# Altium schematic sheet sheet4.SchDoc
size A2
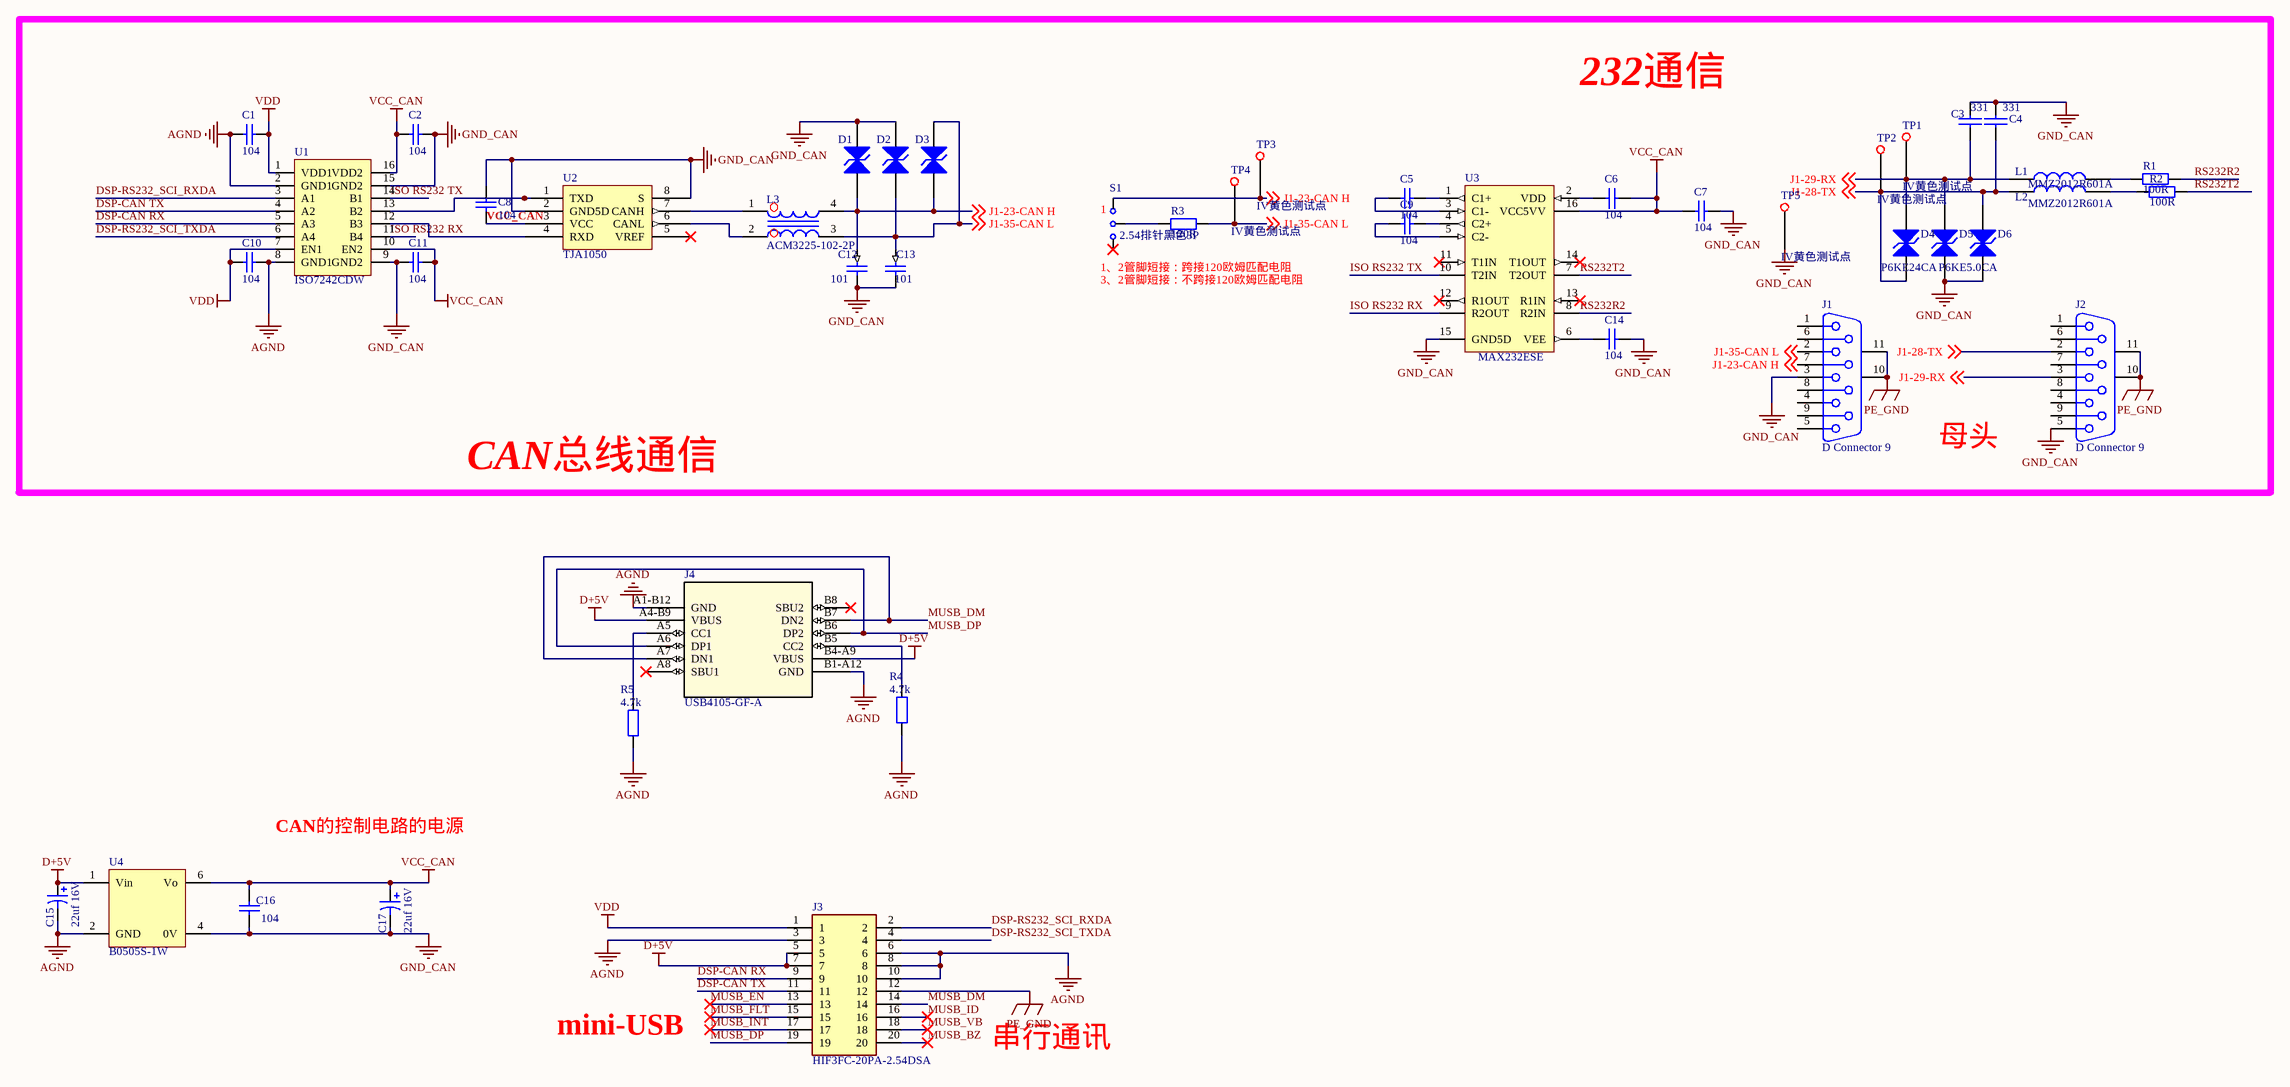
[diagram p0: sheet4.SchDoc]

## Parts
C1  104  [0805]
C2  104  [0805]
C3  331  [0805]
C4  331  [0805]
C5  104  [0805]
C6  104  [0805]
C7  104  [0805]
C8  104  [0805]
C9  104  [0805]
C10  104  [0805]
C11  104  [0805]
C12  101  [0805]
C13  101  [0805]
C14  104  [0805]
C15  22uf 16V  [1206 (钽电容)]
C16  104  [0805]
C17  22uf 16V  [1206 (钽电容)]
D1  (no value)  [DO214AA]
D2  (no value)  [DO214AA]
D3  (no value)  [DO214AA]
D4  P6KE24CA  [DO214AA]
D5  P6KE5.0CA  [DO214AA]
D6  (no value)  [DO214AA]
J1  D Connector 9  [DSUB1.385-2H9]
J2  D Connector 9  [DSUB1.385-2H9]
J3  HIF3FC-20PA-2.54DSA  [SHDR20W56P254_2X10_3290X850X950P]
J4  USB4105-GF-A  [USB4105_GCT]
L1  MMZ2012R601A  [0805]
L2  MMZ2012R601A  [0805]
L3  ACM3225-102-2P  [ACM3225]
R1  100R  [0805]
R2  100R  [0805]
R3  120R  [0805]
R4  4.7k  [0805]
R5  4.7k  [0805]
S1  2.54排针黑色3P  [SIP3]
TP1  IV黄色测试点  [TP]
TP2  IV黄色测试点  [TP]
TP3  IV黄色测试点  [TP]
TP4  IV黄色测试点  [TP]
TP5  IV黄色测试点  [TP]
U1  ISO7242CDW  [SOIC16_L]
U2  TJA1050  [sot96-1_n]
U3  MAX232ESE  [NSO16_N]
U4  B0505S-1W  [B0505S-1W]

## Nets
AGND: C1.1 C10.2 C15.2 J3.3 J3.6 J3.8 J3.10 J4.A1-B12(GND) J4.B1-A12(GND) R4.1 R5.1 U1.2(GND1) U1.8(GND1) U4.2(GND)
D+5V: C15.1 J3.5 J3.7 J4.A4-B9(VBUS) J4.B4-A9(VBUS) U4.1(Vin)
GND_CAN: C2.2 C3.1 C4.1 C7.2 C8.1 C11.1 C12.1 C13.1 C14.2 C16.1 C17.2 D1.2(K) D2.2(K) D5.1(A) D6.1(A) J1.3 J2.5 TP5.1 U1.9(GND2) U1.15(GND2) U2.2(GND5D) U2.8(S) U3.15(GND5D) U4.4(0V)
PE_GND: J1.10(MH1) J1.11(MH2) J2.10(MH1) J2.11(MH2) J3.12
VCC_CAN: C2.1 C6.2 C7.1 C8.2 C11.2 C16.2 C17.1 U1.10(EN2) U1.16(VDD2) U2.3(VCC) U3.16(VCC5VV) U4.6(Vo)
VDD: C1.2 C10.1 J3.1 U1.1(VDD1) U1.7(EN1)
DSP-CAN RX: J3.9 U1.5(A3)
DSP-CAN TX: J3.11 U1.4(A2)
DSP-RS232_SCI_RXDA: J3.2 U1.3(A1)
DSP-RS232_SCI_TXDA: J3.4 U1.6(A4)
ISO RS232 RX: U1.11(B4) U3.9(R2OUT)
ISO RS232 TX: U1.14(B1) U3.10(T2IN)
J1-23-CAN H: C12.2 D1.1(A) D3.1(A) J1.7 L3.4(Sec-) S1.1 TP3.1 ; off-sheet J1-23-CAN H
J1-28-TX: C4.2 D4.1(A) D6.2(K) J2.2 L2.1 TP2.1 ; off-sheet J1-28-TX
J1-29-RX: C3.2 D4.2(K) D5.2(K) J2.3 L1.1 TP1.1 ; off-sheet J1-29-RX
J1-35-CAN L: C13.2 D2.1(A) D3.2(K) J1.2 L3.3(Pri+) R3.1 TP4.1 ; off-sheet J1-35-CAN L
MUSB_BZ: J3.20
MUSB_DM: J3.14 J4.A7(DN1) J4.B7(DN2)
MUSB_DP: J3.19 J4.A6(DP1) J4.B6(DP2)
MUSB_EN: J3.13
MUSB_FLT: J3.15
MUSB_ID: J3.16
MUSB_INT: J3.17
MUSB_VB: J3.18
RS232R2: R1.1 U3.8(R2IN)
RS232T2: R2.1 U3.7(T2OUT)
NetC5_1: C5.1 U3.3(C1-)
NetC5_2: C5.2 U3.1(C1+)
NetC6_1: C6.1 U3.2(VDD)
NetC9_1: C9.1 U3.5(C2-)
NetC9_2: C9.2 U3.4(C2+)
NetC14_1: C14.1 U3.6(VEE)
NetJ4_A5: J4.A5(CC1) R5.2
NetJ4_B5: J4.B5(CC2) R4.2
NetL1_2: L1.2 R1.2
NetL2_2: L2.2 R2.2
NetL3_1: L3.1(Pri+) U2.7(CANH)
NetL3_2: L3.2(Pri-) U2.6(CANL)
NetR3_2: R3.2 S1.2
NetU1_12: U1.12(B3) U2.4(RXD)
NetU1_13: U1.13(B2) U2.1(TXD)

Not connected (* = marked no-connect by the designer): J1 1 4 5 6 8 9; J2 1 4 6 7 8 9; J4 A8(SBU1)* B8(SBU2)*; S1 3*; U2 5(VREF)*; U3 11(T1IN)* 12(R1OUT)* 13(R1IN)* 14(T1OUT)*

## Notes on the sheet
- 232通信
- (near S1) 1
- 1、2管脚短接：跨接120欧姆匹配电阻
- 3、2管脚短接：不跨接120欧姆匹配电阻
- CAN总线通信
- 母头
- CAN的控制电路的电源
- mini-USB
- 串行通讯

## Library data of the parts
C1 C2 C5-C14 C16 = Cap: Capacitor; Published: 8-Jun-2000; LatestRevisionDate: 17-Jul-2002; LatestRevisionNote: Re-released for DXP Platform.; PackageReference: RAD-0.3; Publisher: Altium Limited
  C16: ClassName: Power
C3 C4 = 2KWC2.S01_100nf_54
C15 = Cap Pol1: Polarized Capacitor (Radial); Value: 475; Published: 8-Jun-2000; LatestRevisionDate: 17-Jul-2002; LatestRevisionNote: Re-released for DXP Platform.; PackageReference: RB7.6-15; Publisher: Altium Limited; ClassName: Power
C17 = Cap Pol1: Polarized Capacitor (Radial); Value: 106; Published: 8-Jun-2000; LatestRevisionDate: 17-Jul-2002; LatestRevisionNote: Re-released for DXP Platform.; PackageReference: RB7.6-15; Publisher: Altium Limited; ClassName: Power
D1-D6 = D ZENER2
J1 J2 = D Connector 9: Receptacle Assembly, 9 Position, Right Angle; PackageDocument: O; Positions: 9; Published: 15-Jun-2001; LatestRevisionDate: 17-Jul-2002; LatestRevisionNote: Re-released for DXP Platform.; DatasheetDocument: 1-Sep-1999; PackageReference: 788750; Publisher: Altium Limited; Orientation: Right Angle; Gender: Receptacle
J3 = HIF3FC-20PA-2.54DSA: Connector; Manufacturer_Name: Hirose; Manufacturer_Part_Number: HIF3FC-20PA-2.54DSA(71); Datasheet Link: https://www.hirose.com/product/en/products/HIF3FC/HIF3FC-20PA-2.54DSA%2871%29/; Height: 9.5mm; Mouser Part Number: 798-HIF3FC20PA254D71; Mouser Price/Stock: https://www.mouser.co.uk/ProductDetail/Hirose-Connector/HIF3FC-20PA-254DSA71?qs=eDUdFcBPps3XO21sCrEU%252BQ%3D%3D; Arrow Part Number: HIF3FC-20PA-2.54DSA(71); Arrow Price/Stock: https://www.arrow.com/en/products/hif3fc-20pa-2.54dsa-71/hirose-electric?region=nac; System: Connector
J4 = USB4105-GF-A: No Description Available; Mfr_Name: Global Connector Technology; Copyright: Copyright (C) 2022 Ultra Librarian. All rights reserved.; Manufacturer_Part_Number: USB4105-GF-A; Digi-Key_Part_Number_1: 2073-USB4105-GF-ACT-ND; Digi-Key_Part_Number_2: 2073-USB4105-GF-ADKR-ND; Digi-Key_Part_Number_3: 2073-USB4105-GF-ATR-ND; RefDes: RefDes; Type: DEV
L1 L2 = INDUCTOR
L3 = T6
R1-R5 = Res2: Resistor; Published: 8-Jun-2000; LatestRevisionDate: 17-Jul-2002; LatestRevisionNote: Re-released for DXP Platform.; PackageReference: AXIAL-0.4; Publisher: Altium Limited
S1 = SIP3
TP1-TP5 = 测试点
U1 = Component_1
U2 = AT24C02: U?
U3 = MAX232ESE: +5V Powered, Multi-Channel RS-232 Driver/Receiver; Published: 16-Jan-2001; LatestRevisionDate: 13-Apr-2006; LatestRevisionNote: IPC-7351 Footprint Added.; PackageReference: NSO16; Publisher: Altium Limited; PackageDescription: 16-Pin Small Outline Integrated Circuit 1.27 mm Pitch; Code_JEDEC: MS-012-AC; Code_IPC: SOIC127P600-16; ComponentLink1Description: Manufacturer Link; ComponentLink1URL: http://www.maxim-ic.com/; ComponentLink2Description: Datasheet; ComponentLink2URL: http://pdfserv.maxim-ic.com/en/ds/MAX220-MAX249.pdf
U4 = IB0505LS-W75: ClassName: Power